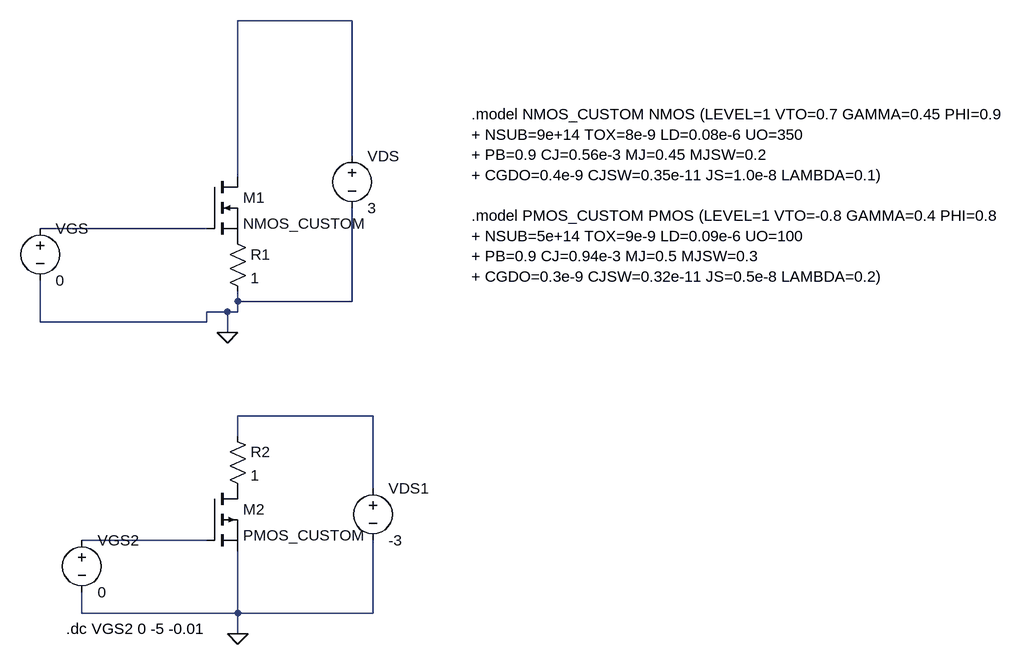
[diagram p0: schematic SimulacionEnLTspice.asc]
SimulacionEnLTspice.asc, the LTspice schematic file:
Version 4
SHEET 1 1012 756
WIRE -32 -208 -208 -208
WIRE -32 0 -32 -208
WIRE -208 32 -208 -208
WIRE -256 112 -512 112
WIRE -208 224 -208 208
WIRE -32 224 -32 80
WIRE -32 224 -208 224
WIRE -224 240 -256 240
WIRE -208 240 -208 224
WIRE -208 240 -224 240
WIRE -512 256 -512 192
WIRE -256 256 -256 240
WIRE -256 256 -512 256
WIRE -224 272 -224 240
WIRE 0 400 -208 400
WIRE -208 432 -208 400
WIRE 0 512 0 400
WIRE -256 592 -448 592
WIRE -448 704 -448 672
WIRE -208 704 -208 608
WIRE -208 704 -448 704
WIRE 0 704 0 592
WIRE 0 704 -208 704
WIRE -208 736 -208 704
FLAG -224 272 0
FLAG -208 736 0
SYMBOL nmos -256 32 R0
SYMATTR InstName M1
SYMATTR Value NMOS_CUSTOM
SYMBOL voltage -512 96 R0
WINDOW 123 0 0 Left 0
WINDOW 39 0 0 Left 0
SYMATTR InstName VGS
SYMATTR Value 0
SYMBOL voltage -32 -16 R0
WINDOW 123 0 0 Left 0
WINDOW 39 0 0 Left 0
SYMATTR InstName VDS
SYMATTR Value 3
SYMBOL res -224 112 R0
SYMATTR InstName R1
SYMATTR Value 1
SYMBOL pmos -256 512 R0
SYMATTR InstName M2
SYMATTR Value PMOS_CUSTOM
SYMBOL voltage 0 496 R0
WINDOW 123 0 0 Left 0
WINDOW 39 0 0 Left 0
SYMATTR InstName VDS1
SYMATTR Value -3
SYMBOL voltage -448 576 R0
WINDOW 123 0 0 Left 0
WINDOW 39 0 0 Left 0
SYMATTR InstName VGS2
SYMATTR Value 0
SYMBOL res -224 416 R0
SYMATTR InstName R2
SYMATTR Value 1
TEXT 152 -64 Left 2 !.model NMOS_CUSTOM NMOS (LEVEL=1 VTO=0.7 GAMMA=0.45 PHI=0.9 \n+ NSUB=9e+14 TOX=8e-9 LD=0.08e-6 UO=350 \n+ PB=0.9 CJ=0.56e-3 MJ=0.45 MJSW=0.2 \n+ CGDO=0.4e-9 CJSW=0.35e-11 JS=1.0e-8 LAMBDA=0.1)\n \n.model PMOS_CUSTOM PMOS (LEVEL=1 VTO=-0.8 GAMMA=0.4 PHI=0.8 \n+ NSUB=5e+14 TOX=9e-9 LD=0.09e-6 UO=100 \n+ PB=0.9 CJ=0.94e-3 MJ=0.5 MJSW=0.3 \n+ CGDO=0.3e-9 CJSW=0.32e-11 JS=0.5e-8 LAMBDA=0.2)
TEXT -472 728 Left 2 !.dc VGS2 0 -5 -0.01

The netlist it stands for:
* SimulacionEnLTspice.asc
M1 N001 N002 P001 P001 NMOS_CUSTOM
VGS N002 0 0
VDS N001 0 3
R1 P001 0 1
M2 P002 N004 0 0 PMOS_CUSTOM
VDS1 N003 0 -3
VGS2 N004 0 0
R2 N003 P002 1
.model NMOS NMOS
.model PMOS PMOS
.lib standard.mos
.model NMOS_CUSTOM NMOS (LEVEL=1 VTO=0.7 GAMMA=0.45 PHI=0.9
+ NSUB=9e+14 TOX=8e-9 LD=0.08e-6 UO=350
+ PB=0.9 CJ=0.56e-3 MJ=0.45 MJSW=0.2
+ CGDO=0.4e-9 CJSW=0.35e-11 JS=1.0e-8 LAMBDA=0.1)
.model PMOS_CUSTOM PMOS (LEVEL=1 VTO=-0.8 GAMMA=0.4 PHI=0.8
+ NSUB=5e+14 TOX=9e-9 LD=0.09e-6 UO=100
+ PB=0.9 CJ=0.94e-3 MJ=0.5 MJSW=0.3
+ CGDO=0.3e-9 CJSW=0.32e-11 JS=0.5e-8 LAMBDA=0.2)
.dc VGS2 0 -5 -0.01
.backanno
.end